# EAGLE schematic bGeigieNanoKit (EAGLE 6.3)
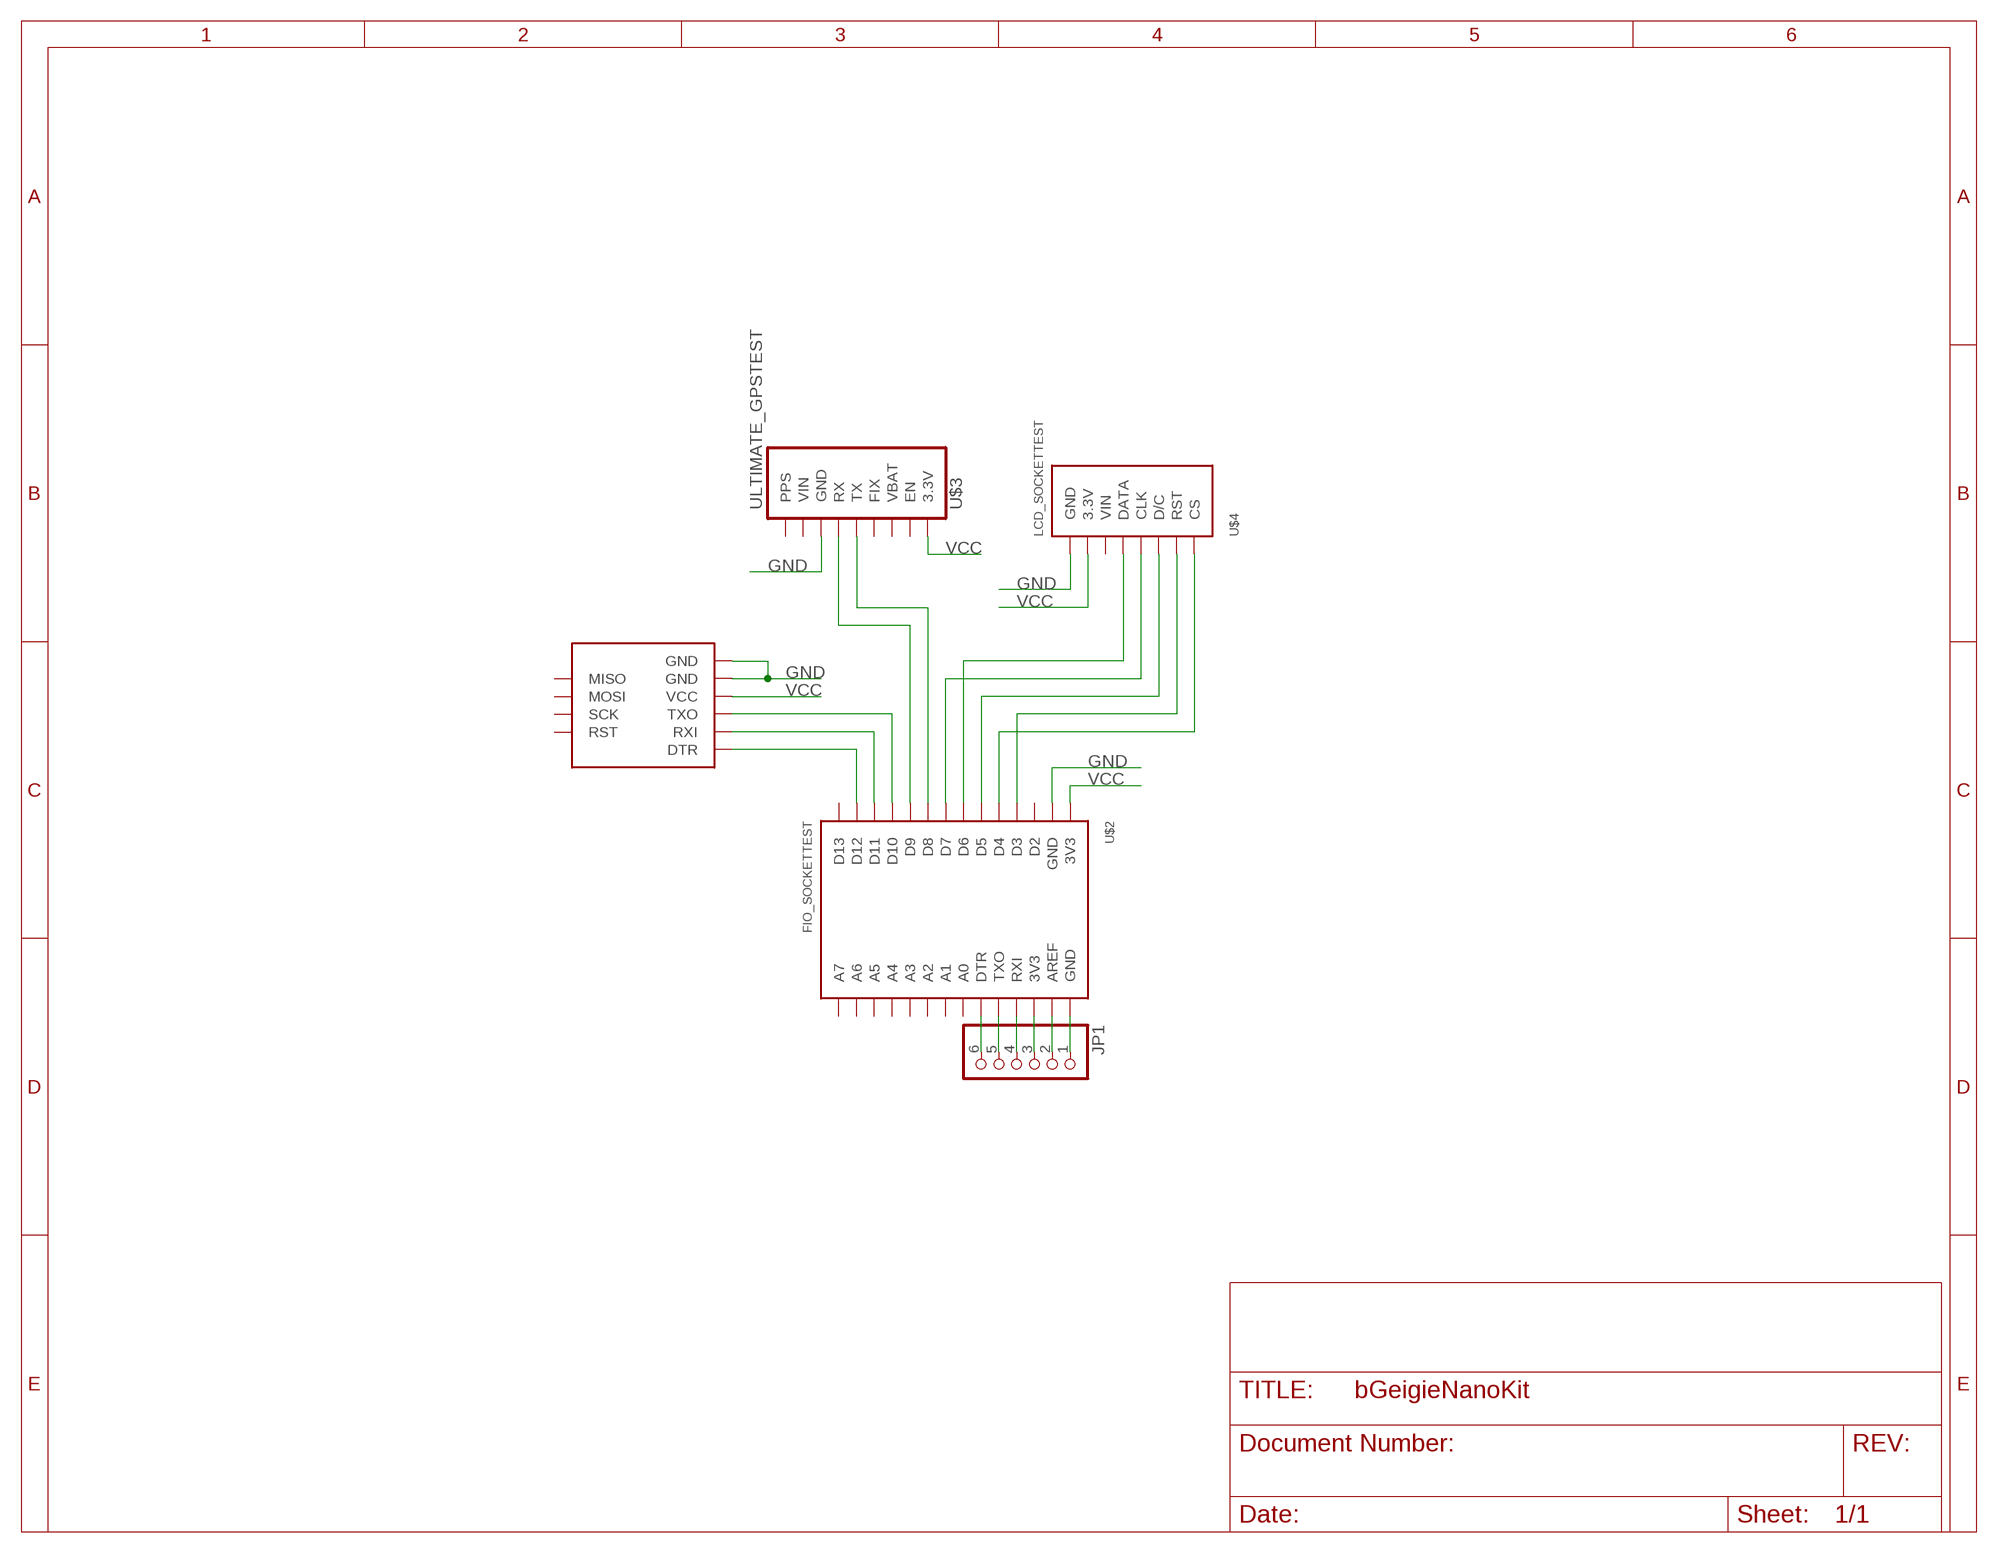
[diagram p0: schematic, sheet 1]

## Parts
JP1  PINHD-1X6  [1X06]
U$1  OPENLOGTEST  [TEST_OPENLOG]
U$2  FIO_SOCKETTEST  [TEST_FIO]
U$3  ULTIMATE_GPSTEST  [TEST_GPS]
U$4  LCD_SOCKETTEST  [TEST_LCD]

## Nets
GND: U$1.JP1$5(GND) U$1.JP1$6(GND) U$2.JP1$2(GND) U$3.JP1$2(GND) U$3.U$8(GND) U$3.U$9(GND) U$4.8(GND) U$4.U$2(GND) U$4.U$3(GND) U$4.U$4(GND) U$4.U$5(GND)
N$1: U$1.JP1$1(DTR) U$2.JP1$13(D12)
N$2: U$1.JP1$2(RXI) U$2.JP1$12(D11)
N$3: U$1.JP1$3(TXO) U$2.JP1$11(D10)
N$4: U$2.JP1$10(D9) U$3.JP1$3(RX)
N$5: U$2.JP1$9(D8) U$3.JP1$4(TX)
N$6: U$2.JP1$7(D6) U$4.5(DATA)
N$7: U$2.JP1$8(D7) U$4.4(CLK)
N$8: U$2.JP1$6(D5) U$4.3(D/C)
N$9: U$2.JP1$4(D3) U$4.2(RST)
N$10: U$2.JP1$5(D4) U$4.1(CS)
N$11: JP1.1 U$2.JP5$1(GND)
N$12: JP1.2 U$2.JP5$2(AREF)
N$13: JP1.3 U$2.JP5$3(3V3)
N$14: JP1.4 U$2.JP5$4(RXI)
N$15: JP1.5 U$2.JP5$5(TXO)
N$16: JP1.6 U$2.JP5$6(DTR)
VCC: U$1.JP1$4(VCC) U$2.JP1$1(3V3) U$3.JP1$8(3.3V) U$4.7(3.3V)
Unconnected: U$1.JP2$1(RST) U$1.JP2$2(SCK) U$1.JP2$3(MOSI) U$1.JP2$4(MISO) U$2.JP1$3(D2) U$2.JP1$14(D13) U$2.JP5$7(A0) U$2.JP5$8(A1) U$2.JP5$9(A2) U$2.JP5$10(A3) U$2.JP5$11(A4) U$2.JP5$12(A5) U$2.JP5$13(A6) U$2.JP5$14(A7) U$3.JP1$5(FIX) U$3.JP1$7(EN) U$3.JP1$9(PPS)

## Power pins joined to a net without a drawn wire
VBAT: U$3.JP1$6(VBAT)
VIN: U$3.JP1$1(VIN) U$4.6(VIN)

## Library data of the parts
JP1 = pinhead:PINHD-1X6: PIN HEADER
U$1 = open_hw_sockets:OPENLOG
U$2 = open_hw_sockets:FIO_SOCKET
U$3 = open_hw_sockets:ULTIMATE_GPS
U$4 = open_hw_sockets:LCD_SOCKET